# EAGLE design ACESJouleThief0PCMnt (EAGLE 9.4.2)
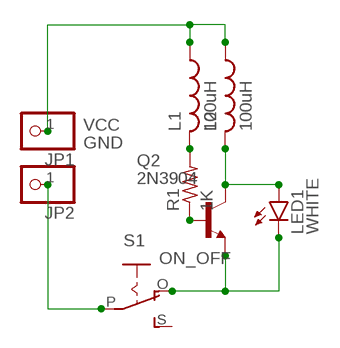
[diagram p0: schematic, sheet 1]

## Parts
JP1  PINHD-1X1  [1X01]
JP2  PINHD-1X1  [1X01]
L1  100uH  L-US0207/10  [0207/10]
L2  100uH  L-US0207/10  [0207/10]
LED1  WHITE  LED5MM  [LED_5MM]
Q2  2N3904  29-NPN-TO92-EBC  [TO92-EBC]
R1  1K  R-US_0207/10  [0207/10]
S1  ON_OFF  EG1218S  [EG1218]

## Nets
GND: JP2.1 S1.P
N$1: Q2.B R1.1
N$4: LED1.K(C) Q2.E S1.O
N$6: L2.2 LED1.A Q2.C
N$11: L1.2 R1.2
VCC: JP1.1 L1.1 L2.1
Unconnected: S1.S

## Library data of the parts
JP1 JP2 = adafruit:PINHD-1X1: Pin header 1x1 for 0.1" spacing With round pins
L1 L2 = rcl:L-US: INDUCTOR, American symbol
LED1 = SparkFun-LED:LED: LED (Generic) Standard schematic elements and footprints for 5mm, 3mm, 1206, and 0603 sized LEDs. Generic LEDs with no color specified.
Q2 = transistor:*-NPN-: NPN Transistror BF959 corrected 2008.03.06
R1 = rcl:R-US_: RESISTOR, American symbol
S1 = adafruit:EG1218: SLIDING SWITCH 0.1" spacing through hole, vertical SPDT slide switch http://www.ladyada.net/library/pcb/eaglelibrary.html

## Board
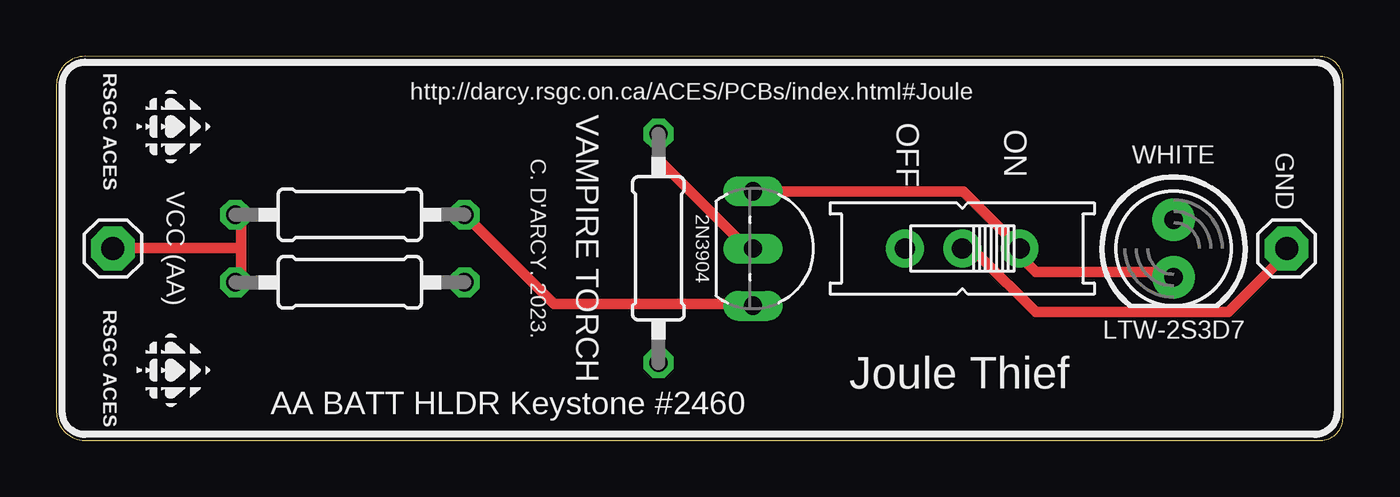
[diagram p1: board, top side]
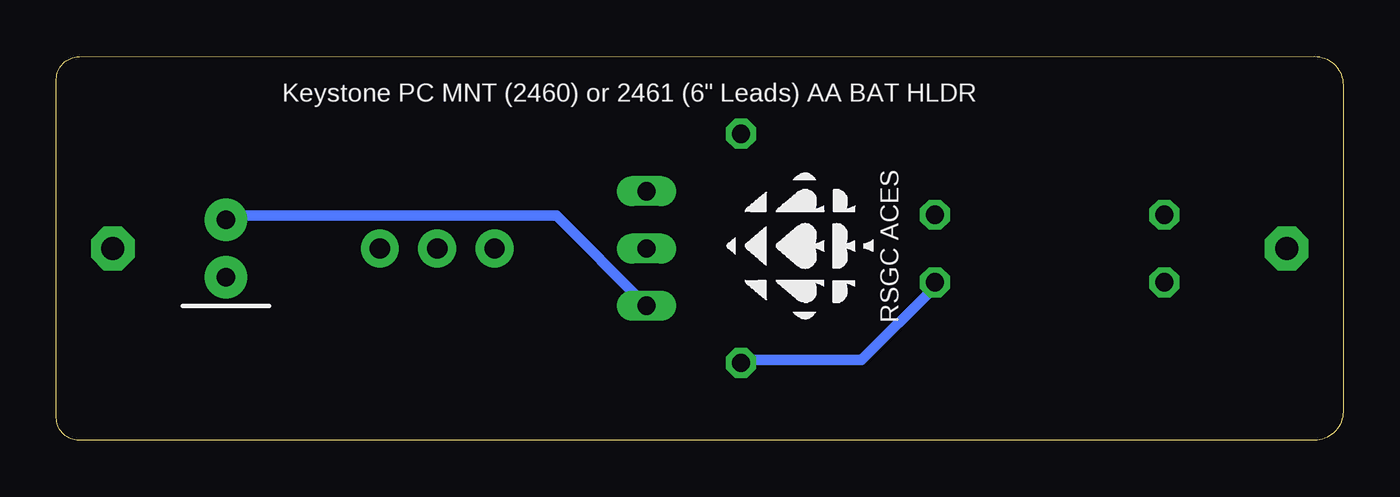
[diagram p2: board, bottom side, seen from below]

Size 57 x 17.02 mm. Coordinates in mm from the lower left corner, seen from the top.
Outline: 0,15.75 0,1.27 arc90 1.27,0 56,0 arc90 57,1 57,16 arc90 56,17 1.27,17.02 arc90 0,15.75
Copper layers (1*16): Top 0.035mm / dielectric 1.5mm / Bottom 0.035mm
Design rules "ACES_THT": minimum track width 18mil, minimum drill 0.35mm, track to track 10mil, track to pad 10mil, pad to pad 10mil, via to via 10mil, smd to smd 6mil, copper to edge 40mil, drill to drill 6mil, minimum pad ring 10mil, minimum via ring 8mil, stop-mask expansion 4mil, vias tented up to drill 0mil, thermal gap 10mil

### Footprints (pad centres in the part's own frame; a part is rotated, then mirrored left to right if it is on the bottom)
1X01 = drill 1.016 pad 1.93 octagon: 1 0,0
0207/10 = drill 0.813 octagon: 1 -5.08,0; 2 5.08,0
LED_5MM = drill 0.813 pad 1.88: A -1.27,0; K 1.27,0
TO92-EBC = drill 0.813 long: B 0,-1.27; C 2.54,-1.27; E -2.54,-1.27
EG1218 = drill 0.9 pad 1.676: O -2.54,0; P 0,0; S 2.54,0

### Placement (x,y rotation side)
JP1  2.5,8.5 0 top
JP2  54.5,8.5 0 top
L1  13,7 0 top
L2  13,10 0 top
LED1  49.49,8.5 270 top
Q2  32.13,8.5 270 top
R1  26.67,8.51 270 top
S1  40.13,8.5 180 top
U$1  [SMALL_TSILK]  5.2,13.9 270 top
U$2  [SMALL_TSILK]  5.2,3.1 270 top
U$3  [MEDIUM_BSILK_TEXT]  23.8,8.6 270 top

### Tracks (layer width: path | path; a pad name or v marks a point on that pad's centre or on a via)
GND
  Top 0.457: S1.P 40.18,8.18 40.89,8.18 43.38,5.69 51.92,5.69 54.41,8.18 JP2.1
N$1
  Top 0.457: R1.1 26.67,12.45 30.58,8.53 Q2.B
N$4
  Top 0.457: Q2.E 30.94,11.02 40.18,11.02 42.67,8.53 S1.O 42.67,8.18 43.38,7.47 49.43,7.47 LED1.K
N$6
  Top 0.457: Q2.C 30.58,6.04 22.05,6.04 18.14,9.96 L2.2
  Bottom 0.457: LED1.A 49.43,9.96 34.85,9.96 30.94,6.04 Q2.C
N$11
  Bottom 0.457: R1.2 26.67,3.56 21.34,3.56 18.14,6.76 L1.2
VCC
  Top 0.457: 8.18,8.53 8.18,9.96 L2.1 | 8.18,8.53 8.18,7.11 L1.1 | 8.18,8.53 2.85,8.53 JP1.1

### Text on the board
tSilk: http://darcy.rsgc.on.ca/ACES/PCBs/index.html#Joule | RSGC ACES | OFF | ON | GND | VAMPIRE TORCH | VCC (AA) | C. D'ARCY. 2023. | LTW-2S3D7 | RSGC ACES | Joule Thief | AA BATT HLDR Keystone #2460
_bSilk: Keystone PC MNT (2460) or 2461 (6" Leads) AA BAT HLDR